# Altium schematic sheet Sheet1.SchDoc
size A; SheetNumber: 1; SheetTotal: 1
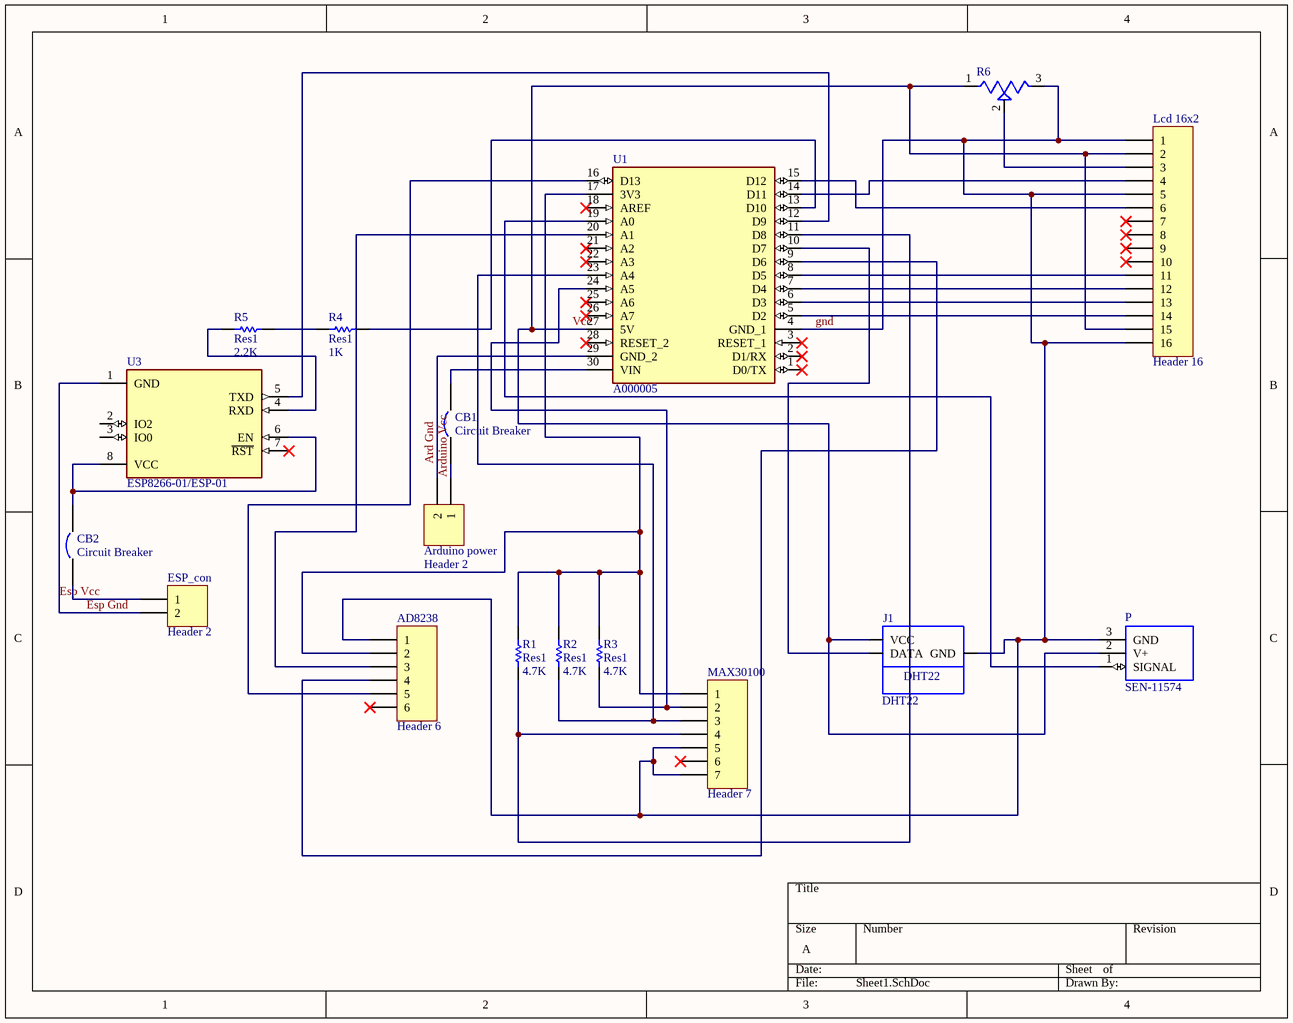
[diagram p0: Sheet1.SchDoc]

## Parts
AD8238  Header 6  [HDR1X6]
Arduino_power  Header 2  [HDR1X2]
CB1  Circuit Breaker  [SPST-2]
CB2  Circuit Breaker  [SPST-2]
ESP_con  Header 2  [HDR1X2]
J1  DHT22  [DHT22]
Lcd_16x2  Header 16  [HDR1X16]
MAX30100  Header 7  [HDR1X7]
P  SEN-11574  [XDCR_SEN-11574]
R1  Res1  value 4.7K  [AXIAL-0.3]
R2  Res1  value 4.7K  [AXIAL-0.3]
R3  Res1  value 4.7K  [AXIAL-0.3]
R4  Res1  value 1K  [AXIAL-0.3]
R5  Res1  value 2.2K  [AXIAL-0.3]
R6  3352T-1-254LF  [TRIM_3352T-1-254LF]  (value not drawn)
U1  A000005  [MODULE_A000005]
U3  ESP8266-01/ESP-01  [XCVR_ESP8266-01/ESP-01]

## Nets
Ard Gnd: Arduino_power.2 U1.29(GND_2)
Arduino Vcc: Arduino_power.1 CB1.1
Esp Gnd: ESP_con.2 U3.1(GND)  [also labelled Esp Vcc]
gnd: AD8238.1 J1.GND Lcd_16x2.1 Lcd_16x2.5 Lcd_16x2.16 MAX30100.5 MAX30100.7 P.3(GND) R6.3(CW) U1.4(GND_1)
Vcc: J1.VCC Lcd_16x2.2 Lcd_16x2.15 P.2(V+) R6.1(CCW) U1.27(5V)
NetAD8238_2: AD8238.2 MAX30100.1 R1.2 R2.2 R3.2 U1.17(3V3)
NetAD8238_3: AD8238.3 U1.20(A1)
NetAD8238_4: AD8238.4 U1.9(D6)
NetAD8238_5: AD8238.5 U1.16(D13)
NetCB1_2: CB1.2 U1.30(VIN)
NetCB2_1: CB2.1 ESP_con.1
NetCB2_2: CB2.2 U3.6(EN) U3.8(VCC)
NetJ1_DATA: J1.DATA U1.10(D7)
NetLcd_16x2_3: Lcd_16x2.3 R6.2(WIPER)
NetLcd_16x2_4: Lcd_16x2.4 U1.14(D11)
NetLcd_16x2_6: Lcd_16x2.6 U1.15(D12)
NetLcd_16x2_11: Lcd_16x2.11 U1.8(D5)
NetLcd_16x2_12: Lcd_16x2.12 U1.7(D4)
NetLcd_16x2_13: Lcd_16x2.13 U1.6(D3)
NetLcd_16x2_14: Lcd_16x2.14 U1.5(D2)
NetMAX30100_2: MAX30100.2 R3.1 U1.24(A5)
NetMAX30100_3: MAX30100.3 R2.1 U1.23(A4)
NetMAX30100_4: MAX30100.4 R1.1 U1.11(D8)
NetP_1: P.1(SIGNAL) U1.19(A0)
NetR4_1: R4.1 R5.2
NetR4_2: R4.2 U1.13(D10)
NetR5_1: R5.1 U3.4(RXD)
NetU1_12: U1.12(D9) U3.5(TXD)

Not connected (* = marked no-connect by the designer): AD8238 6*; Lcd_16x2 7* 8* 9* 10*; MAX30100 6*; U1 1(D0/TX)* 2(D1/RX)* 3(RESET_1)* 18(AREF)* 21(A2)* 22(A3)* 25(A6)* 26(A7)* 28(RESET_2)*; U3 2(IO2) 3(IO0) 7(~{RST})*

## Library data of the parts
AD8238 = Header 6: Header, 6-Pin; LatestRevisionDate: 17-Jul-2002; LatestRevisionNote: Re-released for DXP Platform.; Publisher: Altium Limited
Arduino_power ESP_con = Header 2: Header, 2-Pin; LatestRevisionDate: 17-Jul-2002; LatestRevisionNote: Re-released for DXP Platform.; Publisher: Altium Limited
J1 = DHT22: Capacitive-type humidity and temperature module/sensor; MF: Aosong Electronics; Price: None; Package: Package; MP: DHT22; Value: *; SnapEDA_Link: https://www.snapeda.com/parts/DHT22/Aosong%20Electronics/view-part/5164503/?ref=snap; Check_prices: https://www.snapeda.com/parts/DHT22/Aosong%20Electronics/view-part/5164503/?ref=eda; Availability: Unavailable
Lcd_16x2 = Header 16: Header, 16-Pin; LatestRevisionDate: 17-Jul-2002; LatestRevisionNote: Re-released for DXP Platform.; Publisher: Altium Limited
MAX30100 = Header 7: Header, 7-Pin; LatestRevisionDate: 17-Jul-2002; LatestRevisionNote: Re-released for DXP Platform.; Publisher: Altium Limited
P = SEN-11574: PULSE SENSOR FOR ARDUINO; MF: SparkFun; Package: None; MP: SEN-11574; Availability: Unavailable; Price: None; Value: *; SnapEDA_Link: https://www.snapeda.com/parts/SEN-11574/SparkFun%20Electronics/view-part/1269548/?ref=snap
R1-R5 = Res1: Resistor; Published: 8-Jun-2000; LatestRevisionDate: 17-Jul-2002; LatestRevisionNote: Re-released for DXP Platform.; PackageReference: AXIAL-0.3; Publisher: Altium Limited; PackageDescription: Axial Device, Thru-Hole; 2 Leads; 0.3 in Pin Spacing
R6 = 3352T-1-254LF: RESISTOR, VARIABLE, 250KOHM, 0.5W, Â±20%; Track Resistance:250kohm; No. of Turns:1; Resistance Tolerance:Â± 20%; Temperature Coefficient:Â± 100ppm/Â°C; Power Rating:500mW; Potentiometer Mounting:Through Hole ;RoHS Compliant: Yes; MF: Bourns; Check_prices: https://www.snapeda.com/parts/3352T-1-254LF/Bourns/view-part/?ref=eda; Availability: In Stock; Price: None; Package: 3352T-3 Bourns; Value: *; SnapEDA_Link: https://www.snapeda.com/parts/3352T-1-254LF/Bourns/view-part/?ref=snap; Purchase-URL: https://pricing.snapeda.com/search/part/3352T-1-254LF/?ref=eda; MP: 3352T-1-254LF
U1 = A000005: Small, complete, and breadboard-friendly board based on the ATmega328 (Arduino Nano 3.x).; Check_prices: https://www.snapeda.com/parts/A000005/Arduino/view-part/?ref=eda; Value: *; Availability: In Stock; MP: A000005; Price: None; Package: Non-Standard Arduino; SnapEDA_Link: https://www.snapeda.com/parts/A000005/Arduino/view-part/?ref=snap; Purchase-URL: https://pricing.snapeda.com/search/part/A000005/?ref=eda; MF: Arduino
U3 = ESP8266-01/ESP-01: MakerFocus 4pcs ESP8266 ESP-01 Serial Wireless WiFi Transceiver Receiver Module 1MB SPI Flash DC3.0-3.6V Internet of Things WiFi Module Board Compatible with Ar duino; Value: *; MP: ESP8266-01/ESP-01; Package: None; Availability: Unavailable; Price: None
CB1 CB2 = Circuit Breaker: Published: 24-Mar-1999; LatestRevisionDate: 17-Jul-2002; LatestRevisionNote: Re-released for DXP Platform.; PackageReference: SPST-2; Publisher: Altium Limited; PackageDescription: Switch; 2 Leads